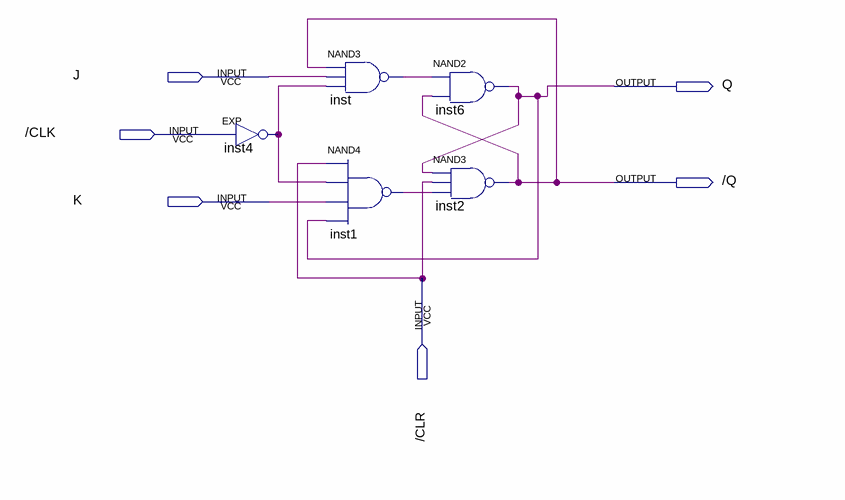
[diagram p0: schematic sheet]
// Quartus schematic FlipFlopJK_SR_CLK.bdf as structural Verilog: 5 symbols, 6 pins
module FlipFlopJK_SR_CLK (
  input  J,
  input  \/CLK ,
  input  K,
  input  \/CLR ,
  output Q,
  output \/Q 
);

  wire inst1_out, inst4_out, inst_out;

  EXP inst4 (.IN(\/CLK ), .OUT(inst4_out));
  nand inst (inst_out, \/Q , J, inst4_out);
  nand inst1 (inst1_out, \/CLR , inst4_out, K, Q);
  nand inst6 (Q, inst_out, \/Q );
  nand inst2 (\/Q , Q, \/CLR , inst1_out);
endmodule
